# Altium schematic sheet ws2812_2020_breakout_mini.SchDoc
size A
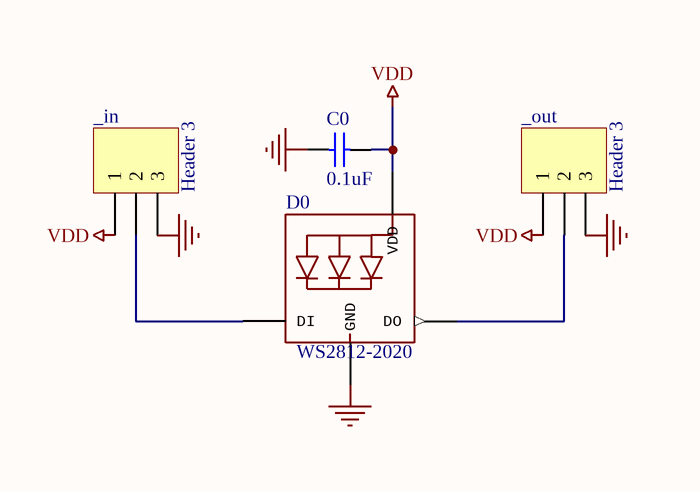
[diagram p0: ws2812_2020_breakout_mini.SchDoc]

## Parts
_in  Header 3  [HDR1X3_SWD]
_out  Header 3  [HDR1X3_SWD]
C0  value 0.1uF  [CAP_0402R]
D0  WS2812-2020  [WS2812-2020]

## Nets
GND: _in.3 _out.3 C0.1 D0.2(GND)
VDD: _in.1 _out.1 C0.2 D0.4(VDD)
Net_in_2: _in.2 D0.3(DI)
Net_out_2: _out.2 D0.1(DO)

## Library data of the parts
_in _out = Header 3: Header, 3-Pin
C0 = CAP: Capacitor
D0 = WS2812-2020: Intelligent control LED integrated light source, low current, 2020 package; Manufacturer: Worldsemi; MPN: WS2812-2020